# Altium schematic sheet power.SchDoc
size A
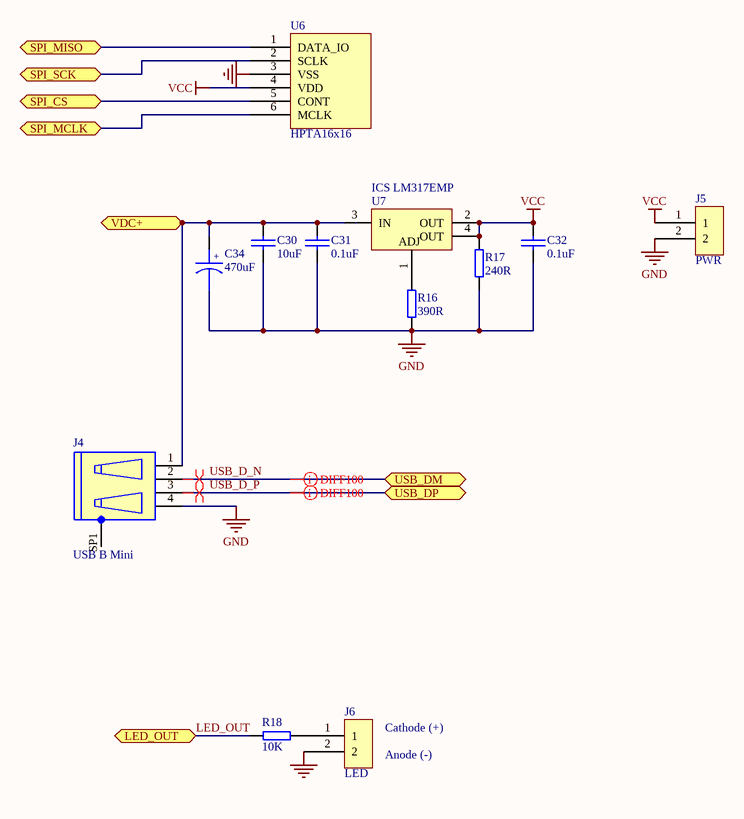
[diagram p0: power.SchDoc]

## Parts
C30  10uF  [0603-IPC]
C31  0.1uF  [0603-IPC]
C32  0.1uF  [0603-IPC]
C34  470uF  [Cap G13]
J4  USB B Mini  [USB MINI B - 5PIN]
J5  PWR  [HDR1X2]
J6  LED  [HDR1X2]
R16  390R  [0603-IPC]
R17  240R  [0603-IPC]
R18  10K  [0603-IPC]
U6  HPTA16x16  [HTPA16x16]
U7  ICS LM317EMP  [SOT-223]

## Ports
LED_OUT (bidir), SPI_CS (bidir), SPI_MCLK (bidir), SPI_MISO (bidir), SPI_SCK (bidir), USB_DM (bidir), USB_DP (bidir), VDC+ (bidir)

## Nets
GND: C30.2 C31.2 C32.2 C34.2 J4.4(GND) J5.2 J6.2 R16.1 R17.1 U6.3(VSS)
VCC: C32.1 J5.1 R17.2 U6.4(VDD) U7.2(OUT) U7.4(OUT)
LED_OUT: R18.2 ; port LED_OUT
SPI_CS: U6.5(CONT) ; port SPI_CS
SPI_MCLK: U6.6(MCLK) ; port SPI_MCLK
SPI_MISO: U6.1(DATA_IO) ; port SPI_MISO
SPI_SCK: U6.2(SCLK) ; port SPI_SCK
USB_D_N: J4.2(DAT1) ; port USB_DM
USB_D_P: J4.3(DAT2) ; port USB_DP
VDC+: C30.1 C31.1 C34.1 J4.1(VBus) U7.3(IN) ; port VDC+
NetJ6_1: J6.1 R18.1
NetR16_2: R16.2 U7.1(ADJ)

Not connected (* = marked no-connect by the designer): J4 NC(Not_Connected_Pin) SP1(Shield)

## Layout directives
differential pair: USB_D_N, USB_D_P
DIFF100: 100: USB_D_N, USB_D_P

## Notes on the sheet
- (near J6) Cathode (+)
- (near J6) Anode (-)
- (in symbol CAP SEL226 35) +

## Library data of the parts
C30-C32 = CAP 0603 XXX: 0.01uF 50V
C34 = CAP SEL226 35: 220F 35V
J4 = CON USB Mini B: USB Mini Connector RA 5 Pin; Manufacturer P/N: 10033526-N3212LF; Manufacturer: FCI; Technology: SMD; Digikey P/N: 609-4700-1-ND; Comment1: USB B Mini; Supplier: Digikey; Supplier 1: Digi-Key; Supplier Part Number 1: 609-4700-1-ND
J5 J6 = 2 Way Header 2.54mm: 2 Way Header
R16 R17 = RES 0603 XXX: RES1206
R18 = RES 0603 XXX: RES0603
U7 = ICS LM317EMP: SOT223 Package, 1 Amp